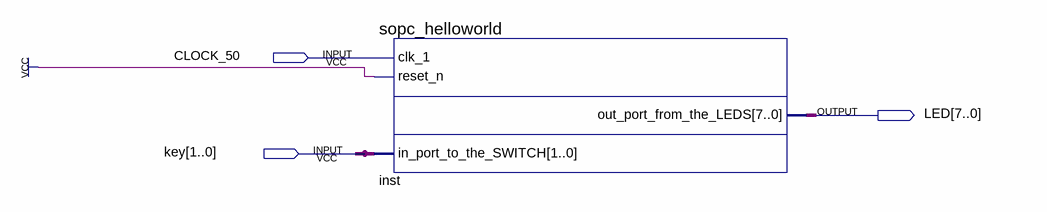
[diagram p0: schematic sheet]
// Quartus schematic sopc-helloworld.bdf as structural Verilog: 1 symbols, 3 pins
module \sopc-helloworld  (
  input  CLOCK_50,
  input  [1:0] key,
  output [7:0] LED
);

  sopc_helloworld inst (.clk_1(CLOCK_50), .reset_n(1'b1), .in_port_to_the_SWITCH(key), .out_port_from_the_LEDS(LED));
endmodule
